# Altium project MainBoardSTM32.PrjPcb
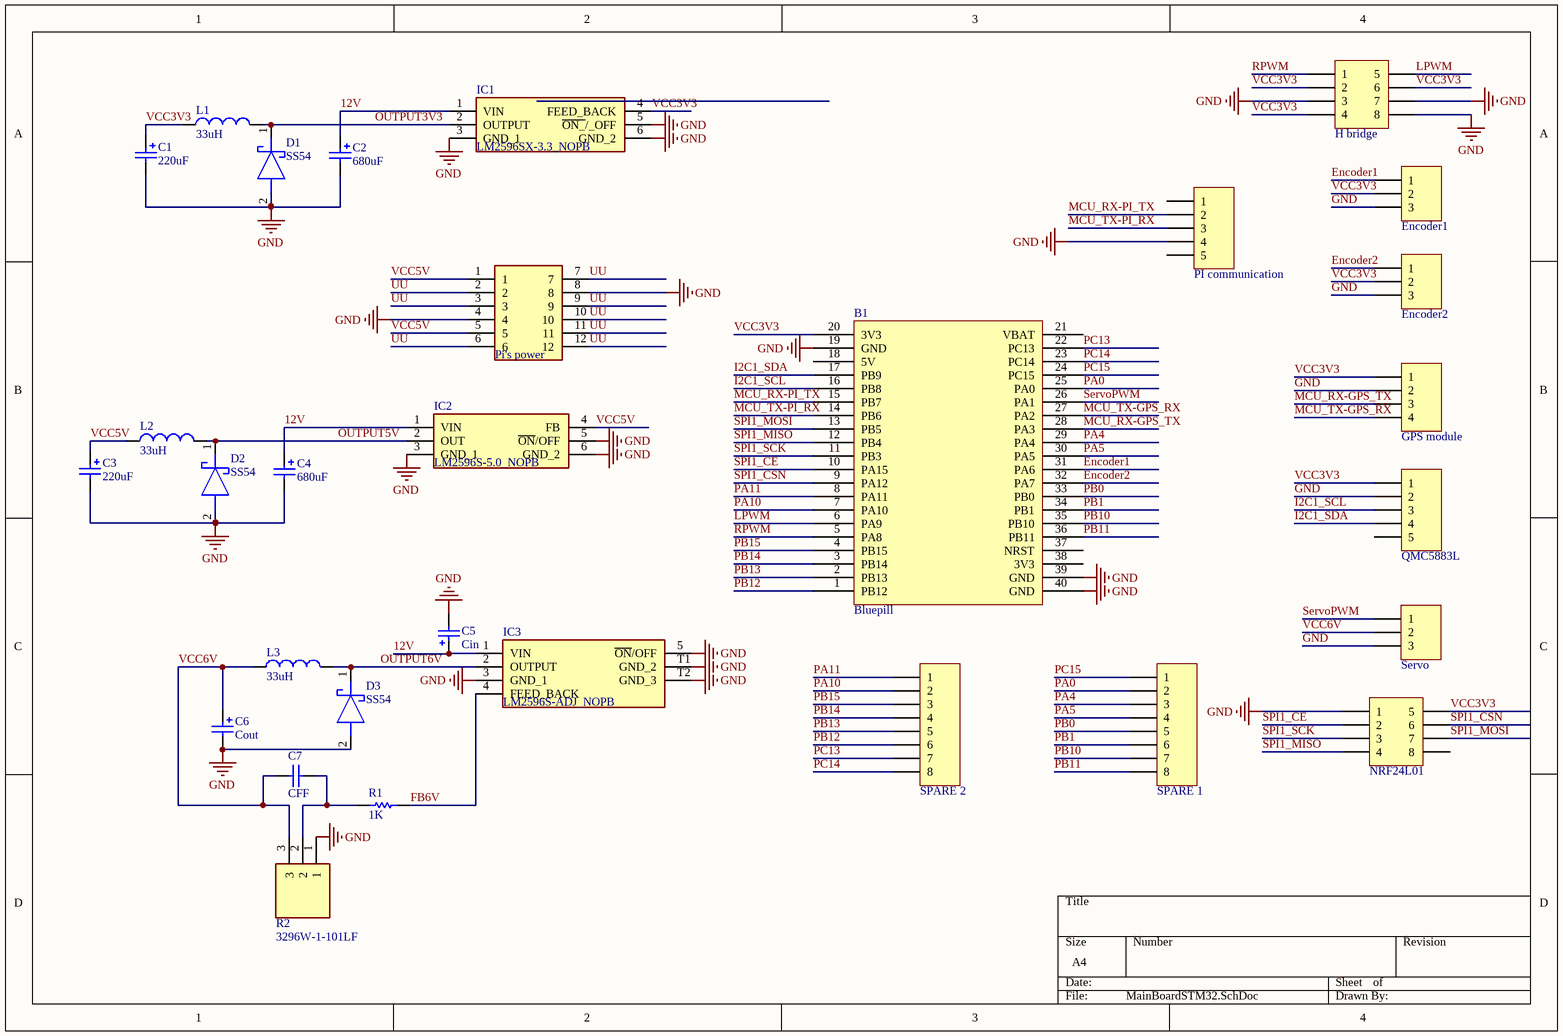
[diagram p0: MainBoardSTM32.SchDoc]
1 sheet, 30 parts. Net scope: global (net labels, ports and power ports of the same name join across sheets).
Board file: MainBoardSTM32.PcbDoc

## Sheet MainBoardSTM32.SchDoc
size A4

### Parts
B1  Bluepill  [Bluepill]
C1  value 220uF  [CAP ALU SIZE B]  (hidden comment: Cap Pol SMD)
C2  value 680uF  [CAP ALU SIZE B]  (hidden comment: Cap Pol SMD)
C3  value 220uF  [CAP ALU SIZE B]  (hidden comment: Cap Pol SMD)
C4  value 680uF  [CAP ALU SIZE B]  (hidden comment: Cap Pol SMD)
C5  Cin  [CAP ALU SIZE B]
C6  Cout  [CAP ALU SIZE B]
C7  CFF  [CAP-SM-0805]
D1  SS54  [DIOM5026X262N]
D2  SS54  [DIOM5026X262N]
D3  SS54  [DIOM5026X262N]
IC1  LM2596SX-3.3_NOPB  [KTT0005B]
IC2  LM2596S-5.0_NOPB  [KTT0005B]
IC3  LM2596S-ADJ_NOPB  [LM2596SXADJ]
J1  Pi's power  [MOLEX-DUALUSB]
L1  value 33uH  [INDUCTOR 12.5x12.5]  (hidden comment: Inductor)
L2  value 33uH  [INDUCTOR 12.5x12.5]  (hidden comment: Inductor)
L3  value 33uH  [INDUCTOR 12.5x12.5]  (hidden comment: Inductor)
P1  H bridge  [JP4x2]
P2  Encoder1  [JP3]
P3  PI communication  [JP5]
P4  Encoder2  [JP3]
P5  GPS module  [JP4]
P6  QMC5883L  [JP5]
P7  Servo  [JP3]
P8  NRF24L01  [JP4x2]
P9  SPARE 2  [JP8]
P10  SPARE 1  [JP8]
R1  value 1K  [RES-SM-0805]  (hidden comment: RESISTOR SMD)
R2  3296W-1-101LF  [3296W-1]

### Nets
GND: B1.19(GND) B1.39(GND) B1.40(GND) C1.2 C2.2 C3.2 C4.2 C5.2 C6.2 D1.2(A) D2.2(A) D3.2(A) IC1.3(GND_1) IC1.5(~{ON_}/_OFF) IC1.6(GND_2) IC2.3(GND_1) IC2.5(~{ON}/OFF) IC2.6(GND_2) IC3.3(GND_1) IC3.5(~{ON}/OFF) IC3.T1(GND_2) IC3.T2(GND_3) J1.4 J1.8 P1.3 P1.7 P1.8 P2.3 P3.4 P4.3 P5.2 P6.2 P7.3 P8.1 R2.1
12V: C2.1 C4.1 C5.1 IC1.1(VIN) IC2.1(VIN) IC3.1(VIN)
Encoder1: B1.31(PA6) P2.1
Encoder2: B1.32(PA7) P4.1
FB6V: IC3.4(FEED_BACK) R1.2
I2C1_SCL: B1.16(PB8) P6.3
I2C1_SDA: B1.17(PB9) P6.4
LPWM: B1.6(PA9) P1.5
MCU_RX-GPS_TX: B1.28(PA3) P5.3
MCU_RX-PI_TX: B1.15(PB7) P3.2
MCU_TX-GPS_RX: B1.27(PA2) P5.4
MCU_TX-PI_RX: B1.14(PB6) P3.3
OUTPUT3V3: D1.1(K) IC1.2(OUTPUT) L1.2
OUTPUT5V: D2.1(K) IC2.2(OUT) L2.2
OUTPUT6V: D3.1(K) IC3.2(OUTPUT) L3.2
PA0: B1.25(PA0) P10.2
PA4: B1.29(PA4) P10.3
PA5: B1.30(PA5) P10.4
PA10: B1.7(PA10) P9.2
PA11: B1.8(PA11) P9.1
PB0: B1.33(PB0) P10.5
PB1: B1.34(PB1) P10.6
PB10: B1.35(PB10) P10.7
PB11: B1.36(PB11) P10.8
PB12: B1.1(PB12) P9.6
PB13: B1.2(PB13) P9.5
PB14: B1.3(PB14) P9.4
PB15: B1.4(PB15) P9.3
PC13: B1.22(PC13) P9.7
PC14: B1.23(PC14) P9.8
PC15: B1.24(PC15) P10.1
RPWM: B1.5(PA8) P1.1
ServoPWM: B1.26(PA1) P7.1
SPI1_CE: B1.10(PA15) P8.2
SPI1_CSN: B1.9(PA12) P8.6
SPI1_MISO: B1.12(PB4) P8.4
SPI1_MOSI: B1.13(PB5) P8.7
SPI1_SCK: B1.11(PB3) P8.3
UU: J1.2 J1.3 J1.6 J1.7 J1.9 J1.10 J1.11 J1.12
VCC3V3: B1.20(3V3) C1.1 IC1.4(FEED_BACK) L1.1 P1.2 P1.4 P1.6 P2.2 P4.2 P5.1 P6.1 P8.5
VCC5V: C3.1 IC2.4(FB) J1.1 J1.5 L2.1
VCC6V: C6.1 C7.1 L3.1 P7.2 R2.3
NetC7_2: C7.2 R1.1 R2.2

Not connected (* = marked no-connect by the designer): B1 18(5V) 21(VBAT) 37(NRST) 38(3V3); P3 1 5; P6 5; P8 8

### Library data of the parts
C1-C4 = Cap Pol SMD: Polarized Capacitor (Radial)
C5 = Cap Pol SMD: Polarized Capacitor (Radial); Value: 470uF
C6 = Cap Pol SMD: Polarized Capacitor (Radial); Value: 220uF
C7 = Cap Non-Pol SMD: Capacitor; Value: 680uF
D1-D3 = SS54: Schottky Diode; Manufacturer_Name: DIYI Elec Tech; Datasheet Link: https://datasheet.lcsc.com/szlcsc/DIYI-Elec-Tech-SS54_C84165.pdf; Height: 2.62mm; Manufacturer_Part_Number: SS54
IC1 = LM2596SX-3.3_NOPB: Integrated Circuit; Manufacturer_Name: Texas Instruments; Manufacturer_Part_Number: LM2596SX-3.3/NOPB; Datasheet Link: http://www.ti.com/lit/gpn/lm2596; Mouser Part Number: 926-LM2596SX33NOPB; Mouser Price/Stock: https://www.mouser.co.uk/ProductDetail/Texas-Instruments/LM2596SX-33-NOPB?qs=X1J7HmVL2ZEm4UYTFC0WWA%3D%3D; Arrow Part Number: LM2596SX-3.3/NOPB; Arrow Price/Stock: https://www.arrow.com/en/products/lm2596sx-3.3nopb/texas-instruments?region=nac
IC2 = LM2596S-5.0_NOPB: Integrated Circuit; Manufacturer_Name: Texas Instruments; Manufacturer_Part_Number: LM2596S-5.0/NOPB; Datasheet Link: https://www.ti.com/lit/gpn/LM2596; Mouser Part Number: 926-LM2596S-5.0/NOPB; Mouser Price/Stock: https://www.mouser.co.uk/ProductDetail/Texas-Instruments/LM2596S-50-NOPB?qs=X1J7HmVL2ZHVjCOmW%252BYINA%3D%3D; Arrow Part Number: LM2596S-5.0/NOPB; Arrow Price/Stock: https://www.arrow.com/en/products/lm2596s-5.0nopb/texas-instruments?region=nac
IC3 = LM2596S-ADJ_NOPB: Integrated Circuit; Manufacturer_Name: Texas Instruments; Manufacturer_Part_Number: LM2596S-ADJ/NOPB; Datasheet Link: https://www.ti.com/lit/ds/symlink/lm2596.pdf?HQS=ti-null-null-sf-df-pf-sep-wwe&ts=1592978195629; Height: 4.57mm; Mouser Part Number: 926-LM2596S-ADJ/NOPB; Mouser Price/Stock: https://www.mouser.co.uk/ProductDetail/Texas-Instruments/LM2596S-ADJ-NOPB?qs=X1J7HmVL2ZHoMN0DLDcNog%3D%3D; Arrow Part Number: LM2596S-ADJ/NOPB; Arrow Price/Stock: https://www.arrow.com/en/products/lm2596s-adjnopb/texas-instruments?region=nac
J1 = 67298-3090: Connector; Manufacturer_Name: Molex; Datasheet Link: https://datasheet.datasheetarchive.com/originals/distributors/Datasheets_SAMA/769e69235f305794a0165724e99951b5.pdf; Manufacturer_Part_Number: 67298-3090; Mouser Part Number: 538-67298-3090; Mouser Price/Stock: https://www.mouser.co.uk/ProductDetail/Molex/67298-3090?qs=x6EjVpvqMVOYHaae5plDDQ%3D%3D
P1 P8 = Header 4X2: Header, 4-Pin, Dual row; LatestRevisionDate: 17-Jul-2002; LatestRevisionNote: Re-released for DXP Platform.; Publisher: Altium Limited
P2 P4 P7 = Header 3: Header, 3-Pin; LatestRevisionDate: 17-Jul-2002; LatestRevisionNote: Re-released for DXP Platform.; Publisher: Altium Limited
P3 P6 = Header 5: Header, 5-Pin; LatestRevisionDate: 17-Jul-2002; LatestRevisionNote: Re-released for DXP Platform.; Publisher: Altium Limited
P5 = Header 4: Header, 4-Pin; LatestRevisionDate: 17-Jul-2002; LatestRevisionNote: Re-released for DXP Platform.; Publisher: Altium Limited
P9 P10 = Header 8: Header, 8-Pin; LatestRevisionDate: 17-Jul-2002; LatestRevisionNote: Re-released for DXP Platform.; Publisher: Altium Limited
R1 = RESISTOR SMD: Resistor
R2 = 3296W-1-101LF: Resistor; Manufacturer_Name: Bourns; Datasheet Link: https://www.bourns.com/pdfs/3296.pdf; Manufacturer_Part_Number: 3296W-1-101LF; Mouser Part Number: 652-3296W-1-101LF; Mouser Price/Stock: https://www.mouser.co.uk/ProductDetail/Bourns/3296W-1-101LF?qs=UcU9LKO1dwEefwKxVJG4Jw%3D%3D; Arrow Part Number: 3296W-1-101LF; Arrow Price/Stock: https://www.arrow.com/en/products/3296w-1-101lf/bourns?region=nac